# EAGLE schematic Start-stop interrupt (EAGLE 9.6.2)
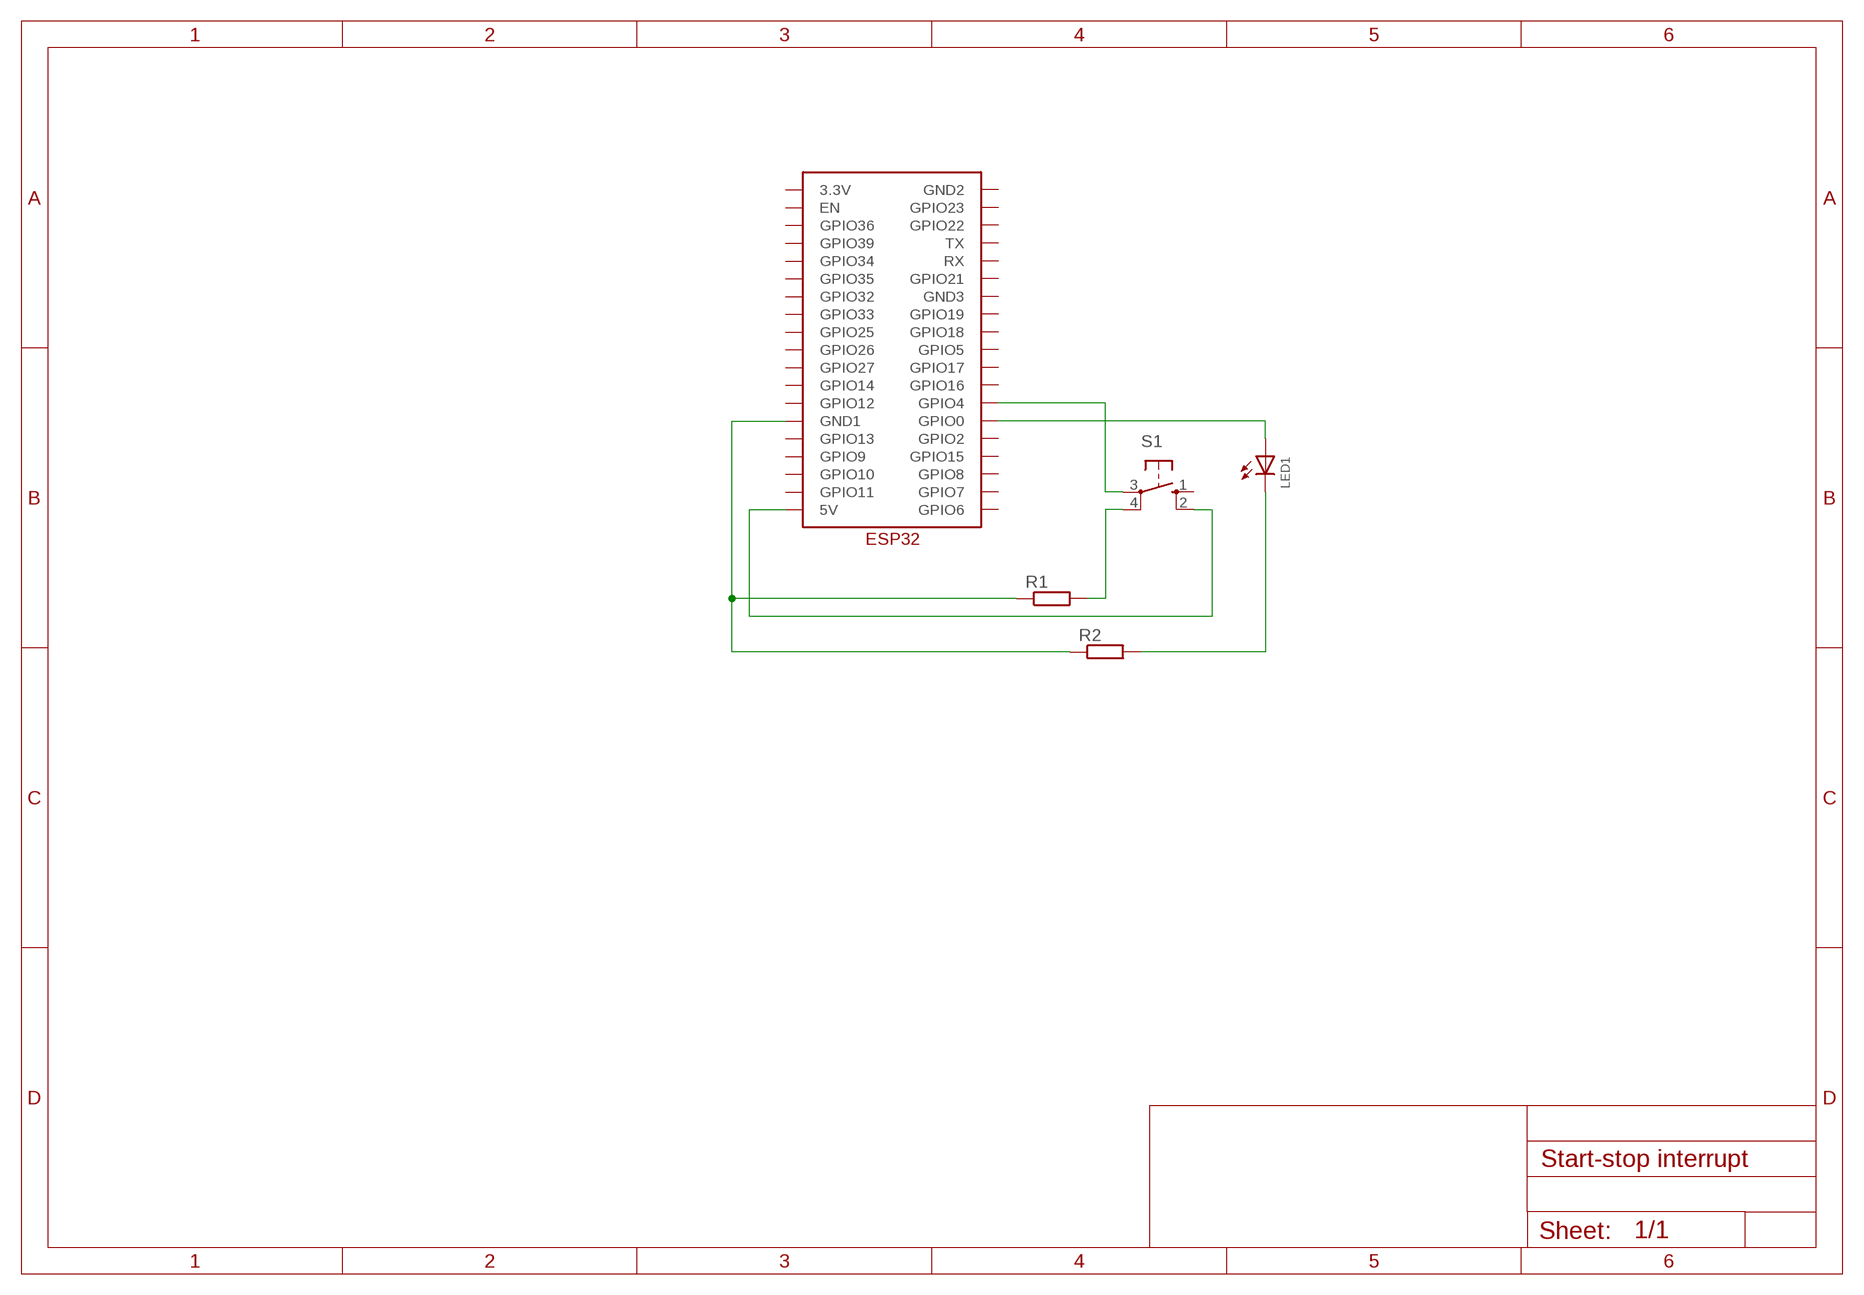
[diagram p0: schematic, sheet 1]

## Parts
LED1  LED-3MM-GREEN  [LED3MM]
R1  R-EU_0204/7  [0204/7]
R2  R-EU_0204/7  [0204/7]
S1  10-XX  [B3F-10XX]
U$1  ESP32_GRBL  [ESP32_GRBL]

## Nets
N$1: S1.3(P) U$1.GPIO4
N$2: R1.1 R2.1 U$1.GND1
N$3: R1.2 S1.4(P1)
N$5: LED1.K(C) R2.2
N$6: LED1.A U$1.GPIO0
N$7: S1.2(S1) U$1.5V
Unconnected: S1.1(S) U$1.3.3V U$1.EN U$1.GND2 U$1.GND3 U$1.GPIO2 U$1.GPIO5 U$1.GPIO6 U$1.GPIO7 U$1.GPIO8 U$1.GPIO9 U$1.GPIO10 U$1.GPIO11 U$1.GPIO12 U$1.GPIO13 U$1.GPIO14 U$1.GPIO15 U$1.GPIO16 U$1.GPIO17 U$1.GPIO18 U$1.GPIO19 U$1.GPIO21 U$1.GPIO22 U$1.GPIO23 U$1.GPIO25 U$1.GPIO26 U$1.GPIO27 U$1.GPIO32 U$1.GPIO33 U$1.GPIO34 U$1.GPIO35 U$1.GPIO36 U$1.GPIO39 U$1.RX U$1.TX

## Library data of the parts
LED1 = Xander:LED-3MM-GREEN: Low Current (2mA) LED 3 mm Tinted Diffused Package color GREEN Source: Data sheet <http://www.farnell.com/datasheets/391098.pdf>; MF: VISHAY SEMICONDUCTOR; OC_FARNELL: 1612435
R1 R2 = Xander:R-EU_: RESISTOR, European symbol
S1 = switch-omron:10-XX: OMRON SWITCH; MPN: B3F-1000; OC_FARNELL: 176432; OC_NEWARK: 36M3542
U$1 = ESP32:ESP32_GRBL